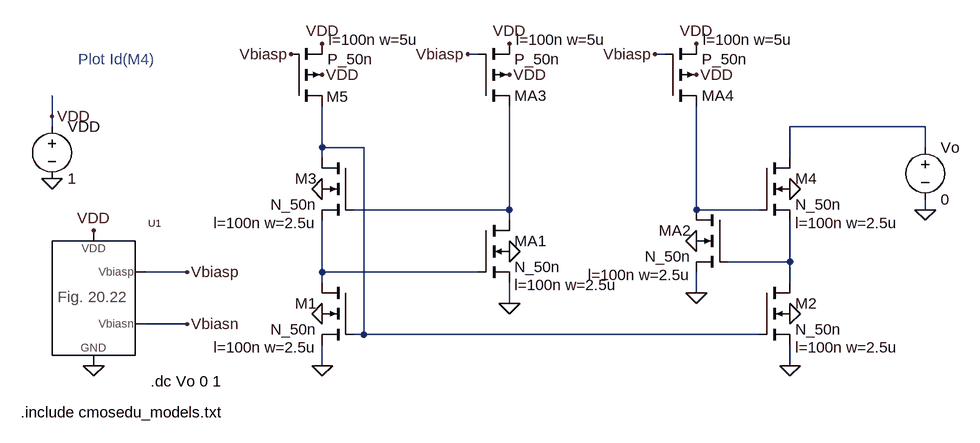
[diagram p0: schematic Fig20_42.asc]
Fig20_42.asc, the LTspice schematic file:
Version 4
SHEET 1 1848 680
WIRE 1104 -304 1088 -304
WIRE 1392 -304 1376 -304
WIRE 448 -208 448 -240
WIRE 448 -192 448 -208
WIRE 1792 -192 1584 -192
WIRE 864 -160 864 -224
WIRE 928 -160 864 -160
WIRE 1792 -160 1792 -192
WIRE 864 -144 864 -160
WIRE 1584 -144 1584 -192
WIRE 1152 -64 1152 -224
WIRE 1152 -64 912 -64
WIRE 1440 -64 1440 -224
WIRE 1536 -64 1440 -64
WIRE 1792 -64 1792 -80
WIRE 1152 -48 1152 -64
WIRE 1584 16 1584 -48
WIRE 1584 16 1488 16
WIRE 656 32 592 32
WIRE 864 32 864 -48
WIRE 1104 32 864 32
WIRE 864 48 864 32
WIRE 1584 48 1584 16
WIRE 1440 64 1440 32
WIRE 1152 80 1152 48
WIRE 656 112 592 112
WIRE 928 128 928 -160
WIRE 928 128 912 128
WIRE 1536 128 928 128
WIRE 864 176 864 144
WIRE 1584 176 1584 144
FLAG 448 -112 0
FLAG 448 -208 VDD
FLAG 512 -32 VDD
FLAG 512 176 0
FLAG 656 32 Vbiasp
FLAG 656 112 Vbiasn
FLAG 1584 96 0
FLAG 1584 176 0
FLAG 1792 -64 0
FLAG 864 -96 0
FLAG 864 96 0
FLAG 864 176 0
FLAG 1584 -96 0
FLAG 864 -320 VDD
FLAG 816 -304 Vbiasp
FLAG 1152 -320 VDD
FLAG 1088 -304 Vbiasp
FLAG 864 -272 VDD
FLAG 1152 -272 VDD
FLAG 1152 0 0
FLAG 1152 80 0
FLAG 1440 -320 VDD
FLAG 1376 -304 Vbiasp
FLAG 1440 -272 VDD
FLAG 1440 -16 0
FLAG 1440 64 0
SYMBOL voltage 448 -208 R0
WINDOW 123 0 0 Left 2
WINDOW 39 0 0 Left 2
SYMATTR InstName VDD
SYMATTR Value 1
SYMBOL nmos4 1536 48 R0
WINDOW 123 56 100 Left 2
SYMATTR Value2 l=100n w=2.5u
SYMATTR InstName M2
SYMATTR Value N_50n
SYMBOL voltage 1792 -176 R0
SYMATTR InstName Vo
SYMATTR Value 0
SYMBOL Fig_20_22 448 80 R0
SYMATTR InstName U1
SYMBOL nmos4 912 -144 M0
WINDOW 123 56 100 Left 2
SYMATTR Value2 l=100n w=2.5u
SYMATTR InstName M3
SYMATTR Value N_50n
SYMBOL nmos4 912 48 M0
WINDOW 123 56 100 Left 2
SYMATTR Value2 l=100n w=2.5u
SYMATTR InstName M1
SYMATTR Value N_50n
SYMBOL nmos4 1536 -144 R0
WINDOW 123 56 100 Left 2
SYMATTR Value2 l=100n w=2.5u
SYMATTR InstName M4
SYMATTR Value N_50n
SYMBOL pmos4 816 -224 M180
WINDOW 123 58 102 Left 2
WINDOW 0 55 14 Left 2
SYMATTR Value2 l=100n w=5u
SYMATTR InstName M5
SYMATTR Value P_50n
SYMBOL pmos4 1104 -224 M180
WINDOW 123 58 102 Left 2
WINDOW 0 56 16 Left 2
SYMATTR Value2 l=100n w=5u
SYMATTR InstName MA3
SYMATTR Value P_50n
SYMBOL nmos4 1104 -48 R0
WINDOW 123 56 100 Left 2
SYMATTR Value2 l=100n w=2.5u
SYMATTR InstName MA1
SYMATTR Value N_50n
SYMBOL pmos4 1392 -224 M180
WINDOW 123 58 102 Left 2
WINDOW 0 56 16 Left 2
SYMATTR Value2 l=100n w=5u
SYMATTR InstName MA4
SYMATTR Value P_50n
SYMBOL nmos4 1488 -64 M0
WINDOW 123 56 100 Left 2
SYMATTR Value2 l=100n w=2.5u
SYMATTR InstName MA2
SYMATTR Value N_50n
TEXT 400 248 Left 2 !.include cmosedu_models.txt
TEXT 488 -296 Left 2 ;Plot Id(M4)
TEXT 600 200 Left 2 !.dc Vo 0 1

The netlist it stands for:
* Fig20_42.asc
VDD VDD 0 1
M2 N005 N002 0 0 N_50n l=100n w=2.5u
Vo N001 0 0
XU1 Vbiasn Vbiasp VDD 0 Fig_20_22  ; pins Vbiasn Vbiasp VDD GND
M3 N002 N003 N006 0 N_50n l=100n w=2.5u
M1 N006 N002 0 0 N_50n l=100n w=2.5u
M4 N001 N004 N005 0 N_50n l=100n w=2.5u
M5 N002 Vbiasp VDD VDD P_50n l=100n w=5u
MA3 N003 Vbiasp VDD VDD P_50n l=100n w=5u
MA1 N003 N006 0 0 N_50n l=100n w=2.5u
MA4 N004 Vbiasp VDD VDD P_50n l=100n w=5u
MA2 N004 N005 0 0 N_50n l=100n w=2.5u
.model NMOS NMOS
.model PMOS PMOS
.lib standard.mos
.include cmosedu_models.txt
* Plot Id(M4)
.dc Vo 0 1
.backanno
.end